# EAGLE design NoiseMaker (EAGLE 7.5.0)
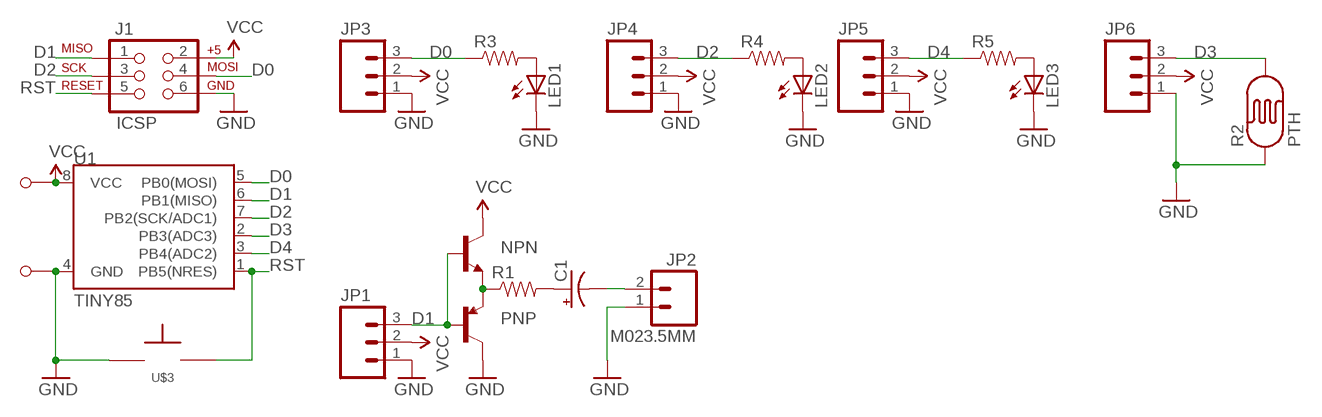
[diagram p0: schematic, sheet 1]

## Parts
C1  CAP_POLPTH1  [CPOL-RADIAL-100UF-25V]
J1  ICSP  AVR_SPI_PRG_6LABELED  [2X3-NS]
JP1  M03PTH  [1X03]
JP2  M023.5MM  [SCREWTERMINAL-3.5MM-2]
JP3  M03PTH  [1X03]
JP4  M03PTH  [1X03]
JP5  M03PTH  [1X03]
JP6  M03PTH  [1X03]
LED1  LEDOVAL  [LED-OVAL]
LED2  LEDOVAL  [LED-OVAL]
LED3  LEDOVAL  [LED-OVAL]
NPN  TRANSISTOR_NPNTO-92-AMMO  [TO-92-AMMO]
PNP  TRANSISTOR_PNPAMMO  [TO-92-AMMO]
R1  RESISTORAXIAL-0.3  [AXIAL-0.3]
R2  PTH  PHOTOCELLPTH  [PHOTOCELL]
R3  RESISTORAXIAL-0.3  [AXIAL-0.3]
R4  RESISTORAXIAL-0.3  [AXIAL-0.3]
R5  RESISTORAXIAL-0.3  [AXIAL-0.3]
U1  TINY85  ATTINY45TINY85-20-DIP  [DIP08]
U$1  M1  [M1_NO_STRAIN]
U$2  M1  [M1_NO_STRAIN]
U$3  TAC_SPST_NO  [TAC_SPST_NO]

## Nets
D0: J1.4(MOSI) JP3.3 R3.P$1 U1.5(PB0(MOSI))
D1: J1.1(MISO) JP1.3 NPN.2(B) PNP.2(B) U1.6(PB1(MISO))
D2: J1.3(SCK) JP4.3 R4.P$1 U1.7(PB2(SCK/ADC1))
D3: JP6.3 R2.2 U1.2(PB3(ADC3))
D4: JP5.3 R5.P$1 U1.3(PB4(ADC2))
GND: J1.6(GND) JP1.1 JP2.1 JP3.1 JP4.1 JP5.1 JP6.1 LED1.CATHODE(C) LED2.CATHODE(C) LED3.CATHODE(C) PNP.3(C) R2.1 U1.4(GND) U$2.P$1 U$3.P$1
N$1: LED1.ANODE(A) R3.P$2
N$2: C1.1(+) R1.P$2
N$3: C1.2(-) JP2.2
N$4: LED2.ANODE(A) R4.P$2
N$5: NPN.1(E) PNP.1(E) R1.P$1
N$6: LED3.ANODE(A) R5.P$2
RST: J1.5(RST) U1.1(PB5(NRES)) U$3.P$2
VCC: J1.2(V+) JP1.2 JP3.2 JP4.2 JP5.2 JP6.2 NPN.3(C) U1.8(VCC) U$1.P$1

## Library data of the parts
C1 = barbary_enterprises:CAP_POL: Capacitor Polarized These are standard SMD and PTH capacitors. Normally 10uF, 47uF, and 100uF in electrolytic and tantalum varieties. Always verify the external diameter of the through hole cap, it varies with capacity, voltage, and manufacturer. The EIA devices should be standard.
J1 = barbary_enterprises:AVR_SPI_PRG_6: AVR ISP 6 Pin This is the reduced ISP connector for AVR programming. Common on Arduino. This footprint will take up less PCB space and can be used with a 10-pin to 6-pin adapter such as SKU: BOB-08508
JP1 JP3-JP6 = SparkFun-Connectors:M03: Header 3 Standard 3-pin 0.1" header. Use with straight break away headers (SKU : PRT-00116), right angle break away headers (PRT-00553), swiss pins (PRT-00743), machine pins (PRT-00117), and female headers (PRT-00115). Molex polarized connector foot print use with SKU : PRT-08232 with associated crimp pins and housings.
JP2 = SparkFun-Connectors:M02: Standard 2-pin 0.1" header. Use with - straight break away headers ( PRT-00116) - right angle break away headers (PRT-00553) - swiss pins (PRT-00743) - machine pins (PRT-00117) - female headers (PRT-00115) Molex polarized connector foot print use with: PRT-08233 with associated crimp pins and housings. 2.54_SCREWTERM for use with PRT-10571. 3.5mm Screw Terminal footprints for PRT-08084 5mm Screw Terminal footprints for use with PRT-08433
LED1-LED3 = barbary_enterprises:LED: LEDs Standard schematic elements and footprints for 5mm, 3mm, 1206, and 0603 sized LEDs. 5mm - Spark Fun Electronics SKU : COM-00529 (and others)
NPN = barbary_enterprises:TRANSISTOR_NPN: Generic NPN BJT MMBT2222A - TRANS-08049 (SOT-23, 1A 40V) MPSA42 - TRANS-09116 (SOT-23, 500mA 300V) MMBT5088LT1G - TRANS-11160 (SOT-23, 50 mA 30V)
PNP = barbary_enterprises:TRANSISTOR_PNP: Generic PNP BJT Double check pinouts against datasheets- not all devices are the same! MMBT3906 - 40V 200mA SOT-23 (TRANS-08052) MMBT4403 - 40V 600mA SOT-23 (TRANS-09245)
R1 R3-R5 = barbary_enterprises:RESISTOR: Resistor Basic schematic elements and footprints for 0603, 1206, and PTH resistors.
R2 = SparkFun-Sensors:PHOTOCELL: CdS photoresistor. This is a low cost way to detect light levels. Resistance decreases with more incoming light. SparkFun SKU: SEN-09088
U1 = SparkFun-DigitalIC:ATTINY45: Atmel 8-pin 2/4/8kB flash uC; PROD_ID: IC-09445; VALUE: TINY85-20-DIP
U$1 U$2 = barbary_enterprises:M1
U$3 = barbary_enterprises:TAC_SPST_NO: 3,5 mm Tact Switches C&K PTS635 Series * Digi-Key Part Number: CKN9102-ND

## Board
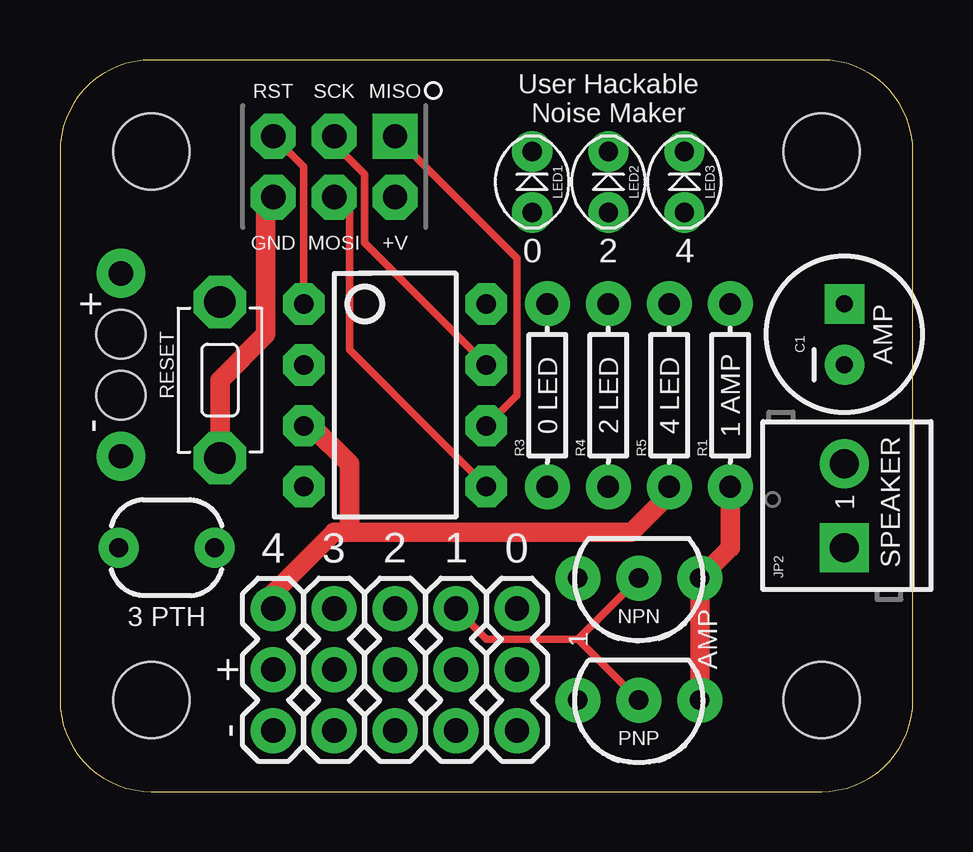
[diagram p1: board, top side]
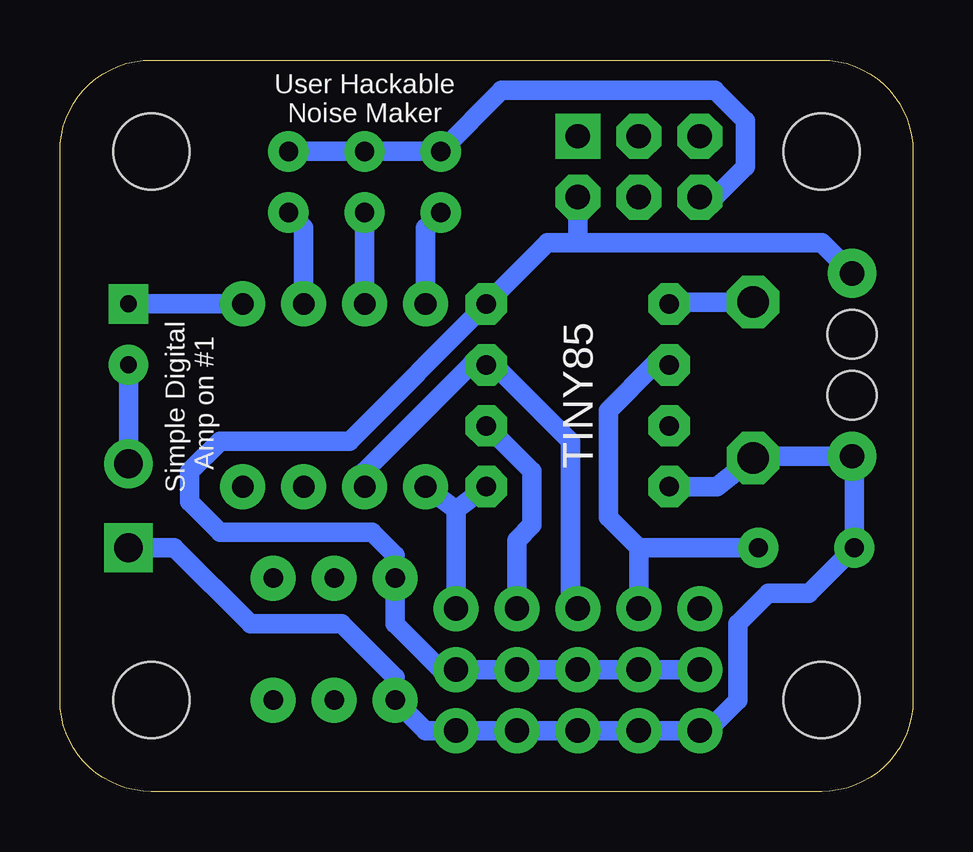
[diagram p2: board, bottom side, seen from below]

Size 35.56 x 30.48 mm. Coordinates in mm from the lower left corner, seen from the top.
Outline: 35.56,3.81 35.56,26.67 arc90 31.75,30.48 3.81,30.48 arc90 0,26.67 0,3.81 arc90 3.81,0 31.75,0 arc90 35.56,3.81
Copper layers (1*16): Top 0.0356mm / dielectric 1.5011mm / Bottom 0.0356mm
Design rules "LaenPCBOrder": minimum track width 6mil, minimum drill 13mil, track to track 6mil, track to pad 6mil, pad to pad 6mil, via to via 6mil, smd to smd 6mil, copper to edge 15mil, drill to drill 6mil, minimum pad ring 7mil, minimum via ring 7mil, stop-mask expansion 3mil, vias tented up to drill 0mil, thermal gap 10mil
Holes 3.17 mm at 3.81,3.81 3.81,26.67 31.75,3.81 31.75,26.67

### Footprints (pad centres in the part's own frame; a part is rotated, then mirrored left to right if it is on the bottom)
CPOL-RADIAL-100UF-25V = drill 0.7 pad 1.651 square: 1 1.27,0 | drill 0.7 pad 1.651: 2 -1.27,0
2X3-NS = drill 1.016 pad 1.88 square: 1 -2.54,-1.27 | drill 1.016 pad 1.88 octagon: 2 -2.54,1.27; 3 0,-1.27; 4 0,1.27; 5 2.54,-1.27; 6 2.54,1.27
1X03 = drill 1.016 pad 1.88: 1 0,0; 2 2.54,0; 3 5.08,0
SCREWTERMINAL-3.5MM-2 = drill 1.2 pad 2.032 square: 1 0,0 | drill 1.2 pad 2.032: 2 3.5,0
LED-OVAL = drill 0.8 pad 1.676: ANODE 1.27,0; CATHODE -1.27,0
TO-92-AMMO = drill 0.813 pad 1.88: 1 -2.54,0; 2 0,0; 3 2.54,0
AXIAL-0.3 = drill 0.9 pad 1.88: P$1 -3.81,0; P$2 3.81,0
PHOTOCELL = drill 0.8 pad 1.676: 1 -2,0; 2 2,0
DIP08 = drill 0.813 pad 1.727 octagon: 1 -3.81,-3.81; 2 -1.27,-3.81; 3 1.27,-3.81; 4 3.81,-3.81; 5 3.81,3.81; 6 1.27,3.81; 7 -1.27,3.81; 8 -3.81,3.81
M1_NO_STRAIN = drill 1.016 pad 2.032: P$1 0,0 | hole 2.032: 2.54,0
TAC_SPST_NO = drill 1.3 pad 2.184 octagon: P$1 -3.251,0; P$2 3.251,0

### Placement (x,y rotation side)
C1  32.7,19.05 90 top
J1  11.43,26.04 180 top
JP1  16.51,2.54 90 top
JP2  32.7,10.16 90 top
JP3  19.05,2.54 90 top
JP4  13.97,2.54 90 top
JP5  8.89,2.54 90 top
JP6  11.43,2.54 90 top
LED1  19.68,25.4 270 top
LED2  22.86,25.4 270 top
LED3  26.04,25.4 270 top
NPN  24.13,8.89 180 top
PNP  24.13,3.81 180 top
R1  27.94,16.51 90 top
R2  4.45,10.16 0 top
R3  20.32,16.51 90 top
R4  22.86,16.51 90 top
R5  25.4,16.51 90 top
U1  13.97,16.51 270 top
U$1  2.54,21.59 270 top
U$2  2.54,13.97 90 top
U$3  6.67,17.14 90 top

### Tracks (layer width: path | path; a pad name or v marks a point on that pad's centre or on a via)
D0
  Top 0.305: J1.4 12.06,24.13 12.06,18.41 U1.5
  Bottom 0.813: 19.05,11.75 JP3.3 | U1.5 19.05,11.75 | 19.05,11.75 R3.P$1
D1
  Top 0.305: JP1.3 17.78,6.35 21.59,6.35 | 21.59,6.35 PNP.2 | 21.59,6.35 NPN.2 | J1.1 19.05,22.23 19.05,16.51 U1.6
  Bottom 0.813: U1.6 15.88,13.34 15.88,11.11 16.51,10.48 JP1.3
D2
  Top 0.305: J1.3 11.43,26.99 12.7,25.72 12.7,22.86 U1.7
  Bottom 0.813: R4.P$1 22.86,13.34 18.41,17.78 U1.7 17.46,17.78 14.29,14.61 14.29,7.94 JP4.3
D3
  Bottom 0.813: JP6.3 11.43,10.16 | 11.43,10.16 12.7,11.43 12.7,15.88 10.79,17.78 U1.2 | R2.2 11.43,10.16
D4
  Top 0.813: R5.P$1 25.4,12.38 23.81,10.79 12.06,10.79 | 12.06,10.79 11.43,10.79 8.89,8.26 JP5.3 | U1.3 10.48,15.24 12.06,13.65 12.06,10.79
GND
  Top 0.813: U$3.P$1 6.67,17.14 8.57,19.05 8.57,24.45 J1.6
  Bottom 0.813: U1.4 8.18,12.7 U$3.P$1 6.43,13.97 U$2.P$1 2.44,13.88 R2.1 4.35,8.26 6.03,8.26 7.3,6.99 7.3,3.81 8.57,2.54 JP5.1 JP6.1 JP4.1 JP1.1 JP3.1 20.32,2.54 PNP.3 21.59,4.76 23.81,6.99 27.62,6.99 30.8,10.16 JP2.1 | LED3.CATHODE LED2.CATHODE LED1.CATHODE 17.14,29.21 8.26,29.21 6.99,27.94 6.99,26.04 8.26,24.77 J1.6
N$1
  Bottom 0.813: R3.P$2 20.32,23.5 LED1.ANODE
N$2
  Bottom 0.813: R1.P$2 C1.1
N$3
  Bottom 0.813: C1.2 JP2.2
N$4
  Bottom 0.813: R4.P$2 LED2.ANODE
N$5
  Top 0.813: R1.P$1 27.94,10.16 NPN.1 PNP.1
N$6
  Bottom 0.813: R5.P$2 25.4,23.5 LED3.ANODE
RST
  Top 0.305: J1.5 10.16,26.04 U1.1
  Bottom 0.813: U$3.P$2 10.08,20.4 U1.1
VCC
  Bottom 0.813: JP5.2 JP6.2 JP4.2 JP1.2 JP3.2 19.68,5.08 21.59,6.99 NPN.3 21.59,9.84 22.54,10.79 28.89,10.79 30.16,12.06 30.16,13.34 28.89,14.61 23.5,14.61 U1.8 15.24,22.86 13.97,22.86 | J1.2 13.97,22.86 | 13.97,22.86 3.81,22.86 U$1.P$1

### Text on the board
tPlace: User Hackable / Noise Maker | 0 | 2 | 4 | + | AMP | RESET | 0 LED | 2 LED | 4 LED | 1 AMP | - | 1 | SPEAKER | 4 | 3 | 2 | 1 | 0 | 3 PTH | 1 | AMP | + | -
bPlace: User Hackable / Noise Maker | TINY85 | Simple Digital / Amp on #1